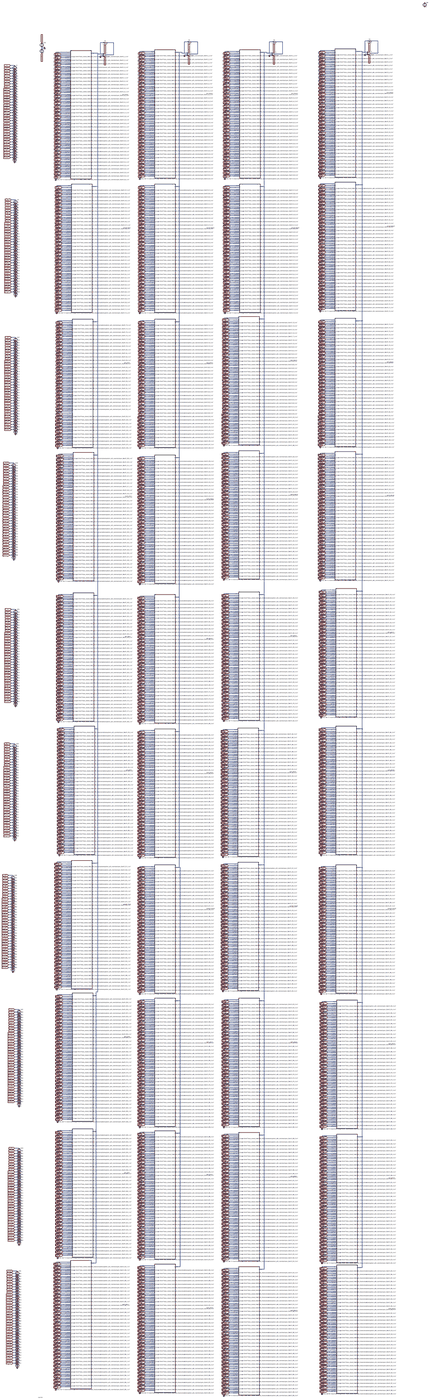
[diagram p0: schematic bangla_font_pattern_arka.asc, whole sheet]
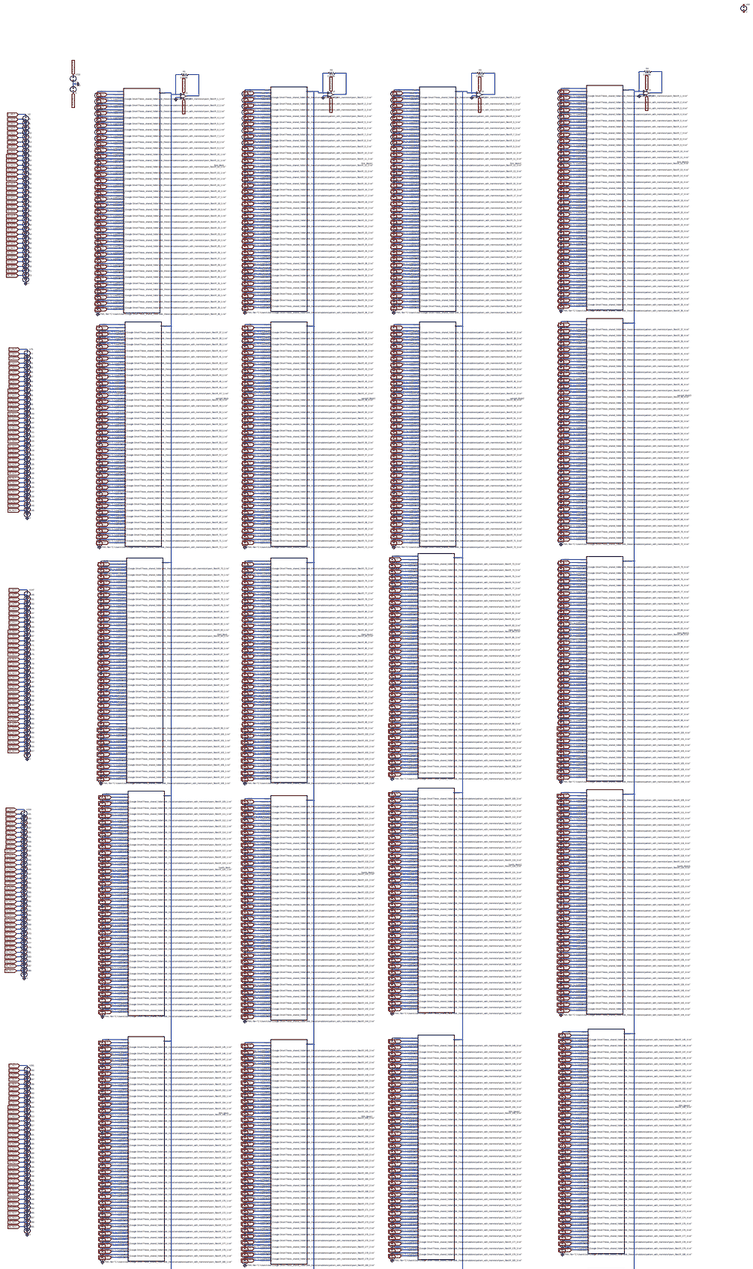
[diagram p1: schematic bangla_font_pattern_arka.asc, part, row 1 of 2, column 1 of 1]
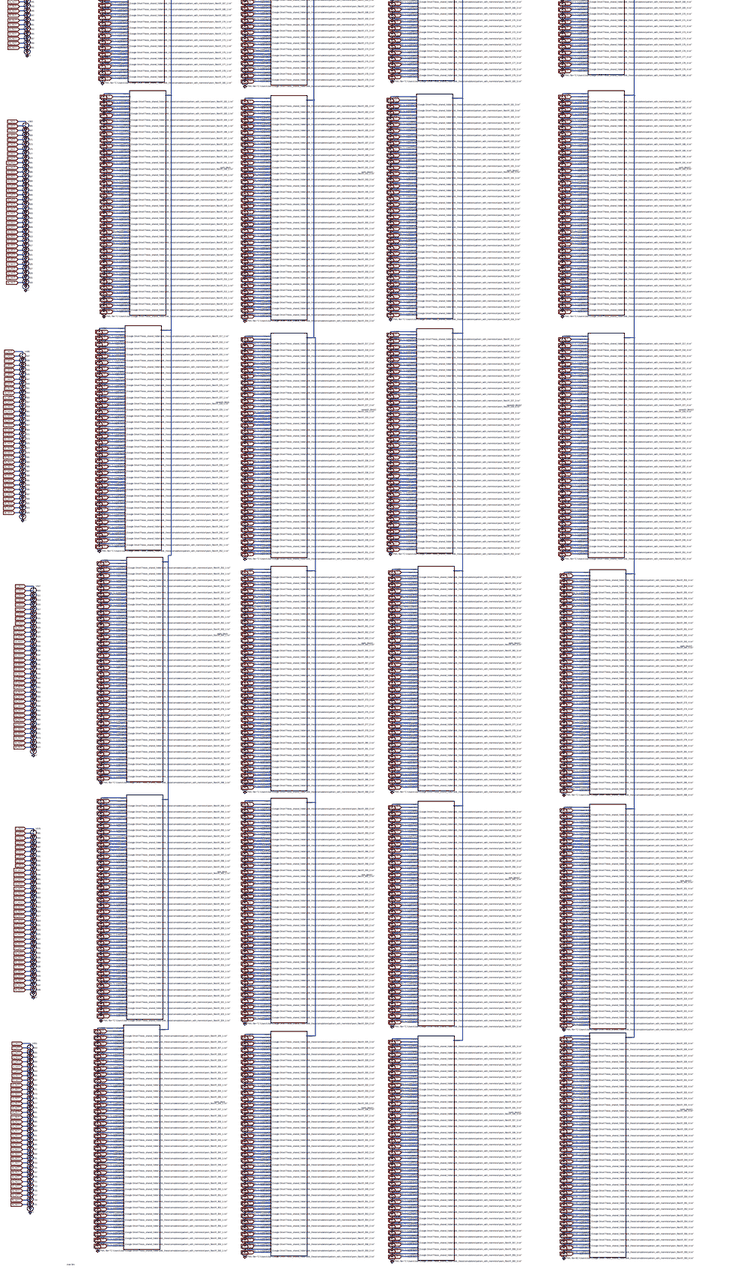
[diagram p2: schematic bangla_font_pattern_arka.asc, part, row 2 of 2, column 1 of 1]
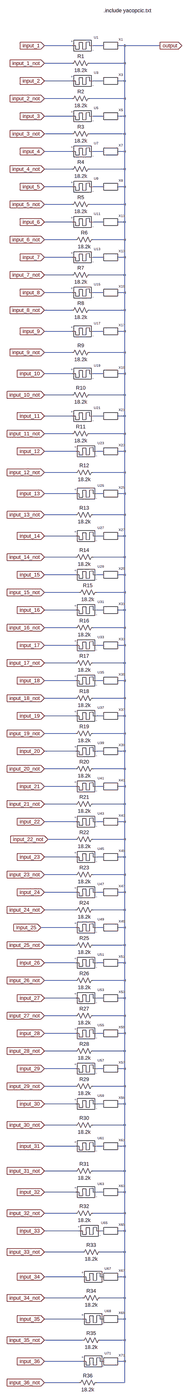
[diagram p3: sub-circuit memristor_block.asc, whole sheet]
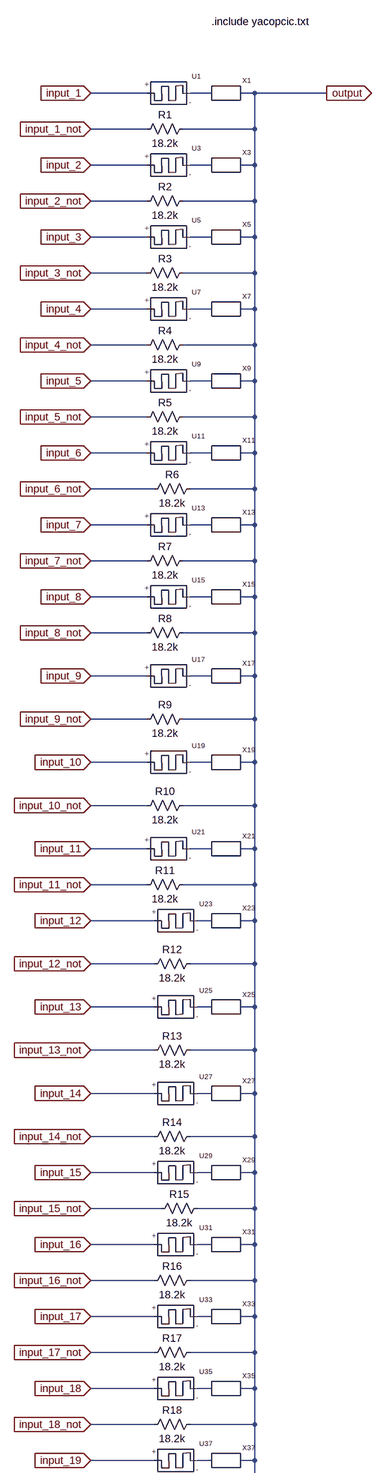
[diagram p4: sub-circuit memristor_block.asc, part, row 1 of 2, column 1 of 1]
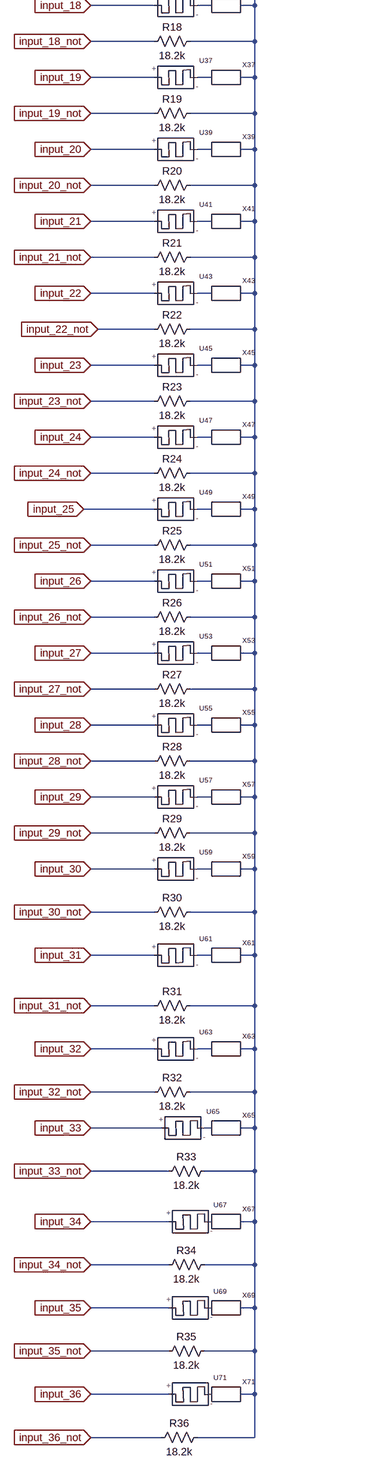
[diagram p5: sub-circuit memristor_block.asc, part, row 2 of 2, column 1 of 1]
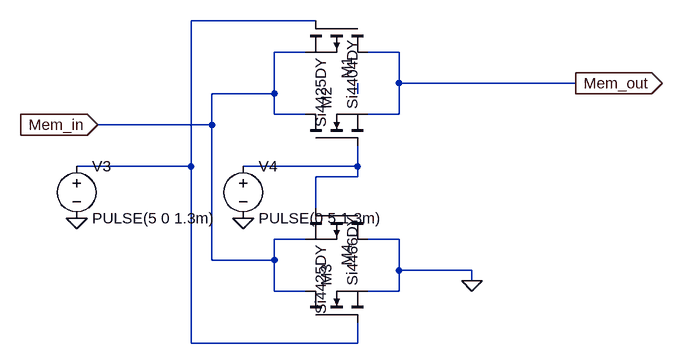
[diagram p6: sub-circuit programmer_with_transmission.asc]
* bangla_font_pattern_arka.asc
Xfirst_block N012 1_NOT N016 2_NOT N020 3_NOT N024 4_NOT N028 5_NOT N032 6_NOT N036 7_NOT N040 8_NOT N007 N044 9_NOT N048 10_NOT N052 11_NOT N056 12_NOT N060 13_NOT N064 14_NOT N068 15_NOT N072 16_NOT N076 17_NOT N080 18_NOT N084 19_NOT N088 20_NOT N092 21_NOT N096 22_NOT N100 23_NOT N104 24_NOT N108 25_NOT N112 26_NOT N116 27_NOT N120 28_NOT N124 29_NOT N128 30_NOT N132 31_NOT N136 32_NOT N140 33_NOT N144 34_NOT N148 35_NOT N152 36_NOT memristor_block
V1 N012 0 PWL file="C:\Users\Anik\Google Drive\Thesis_shared_folder\anik_thesis\simulations\pattern_with_memristor\pwm_files\R_1_1.txt"
V3 N016 0 PWL file="C:\Users\Anik\Google Drive\Thesis_shared_folder\anik_thesis\simulations\pattern_with_memristor\pwm_files\R_2_1.txt"
V5 N020 0 PWL file="C:\Users\Anik\Google Drive\Thesis_shared_folder\anik_thesis\simulations\pattern_with_memristor\pwm_files\R_3_1.txt"
V7 N024 0 PWL file="C:\Users\Anik\Google Drive\Thesis_shared_folder\anik_thesis\simulations\pattern_with_memristor\pwm_files\R_4_1.txt"
V9 N028 0 PWL file="C:\Users\Anik\Google Drive\Thesis_shared_folder\anik_thesis\simulations\pattern_with_memristor\pwm_files\R_5_1.txt"
V11 N032 0 PWL file="C:\Users\Anik\Google Drive\Thesis_shared_folder\anik_thesis\simulations\pattern_with_memristor\pwm_files\R_6_1.txt"
V13 N036 0 PWL file="C:\Users\Anik\Google Drive\Thesis_shared_folder\anik_thesis\simulations\pattern_with_memristor\pwm_files\R_7_1.txt"
V15 N040 0 PWL file="C:\Users\Anik\Google Drive\Thesis_shared_folder\anik_thesis\simulations\pattern_with_memristor\pwm_files\R_8_1.txt"
V17 N044 0 PWL file="C:\Users\Anik\Google Drive\Thesis_shared_folder\anik_thesis\simulations\pattern_with_memristor\pwm_files\R_9_1.txt"
V19 N048 0 PWL file="C:\Users\Anik\Google Drive\Thesis_shared_folder\anik_thesis\simulations\pattern_with_memristor\pwm_files\R_10_1.txt"
V21 N052 0 PWL file="C:\Users\Anik\Google Drive\Thesis_shared_folder\anik_thesis\simulations\pattern_with_memristor\pwm_files\R_11_1.txt"
V23 N056 0 PWL file="C:\Users\Anik\Google Drive\Thesis_shared_folder\anik_thesis\simulations\pattern_with_memristor\pwm_files\R_12_1.txt"
V25 N060 0 PWL file="C:\Users\Anik\Google Drive\Thesis_shared_folder\anik_thesis\simulations\pattern_with_memristor\pwm_files\R_13_1.txt"
V27 N064 0 PWL file="C:\Users\Anik\Google Drive\Thesis_shared_folder\anik_thesis\simulations\pattern_with_memristor\pwm_files\R_14_1.txt"
V29 N068 NC_01 PWL file="C:\Users\Anik\Google Drive\Thesis_shared_folder\anik_thesis\simulations\pattern_with_memristor\pwm_files\R_15_1.txt"
V31 N072 0 PWL file="C:\Users\User\Google Drive\Thesis_shared_folder\anik_thesis\simulations\pattern_with_memristor\pwm_files\R_16_1.txt"
V33 N076 0 PWL file="C:\Users\User\Google Drive\Thesis_shared_folder\anik_thesis\simulations\pattern_with_memristor\pwm_files\R_17_1.txt"
V35 N080 NC_02 PWL file="C:\Users\User\Google Drive\Thesis_shared_folder\anik_thesis\simulations\pattern_with_memristor\pwm_files\R_18_1.txt"
V37 N084 0 PWL file="C:\Users\User\Google Drive\Thesis_shared_folder\anik_thesis\simulations\pattern_with_memristor\pwm_files\R_19_1.txt"
V39 N088 0 PWL file="C:\Users\User\Google Drive\Thesis_shared_folder\anik_thesis\simulations\pattern_with_memristor\pwm_files\R_20_1.txt"
V41 N092 0 PWL file="C:\Users\User\Google Drive\Thesis_shared_folder\anik_thesis\simulations\pattern_with_memristor\pwm_files\R_21_1.txt"
V43 N096 0 PWL file="C:\Users\User\Google Drive\Thesis_shared_folder\anik_thesis\simulations\pattern_with_memristor\pwm_files\R_22_1.txt"
V45 N100 0 PWL file="C:\Users\User\Google Drive\Thesis_shared_folder\anik_thesis\simulations\pattern_with_memristor\pwm_files\R_23_1.txt"
V47 N104 0 PWL file="C:\Users\User\Google Drive\Thesis_shared_folder\anik_thesis\simulations\pattern_with_memristor\pwm_files\R_24_1.txt"
V49 N108 0 PWL file="C:\Users\User\Google Drive\Thesis_shared_folder\anik_thesis\simulations\pattern_with_memristor\pwm_files\R_25_1.txt"
V51 N112 0 PWL file="C:\Users\User\Google Drive\Thesis_shared_folder\anik_thesis\simulations\pattern_with_memristor\pwm_files\R_26_1.txt"
V53 N116 0 PWL file="C:\Users\User\Google Drive\Thesis_shared_folder\anik_thesis\simulations\pattern_with_memristor\pwm_files\R_27_1.txt"
V55 N120 0 PWL file="C:\Users\User\Google Drive\Thesis_shared_folder\anik_thesis\simulations\pattern_with_memristor\pwm_files\R_28_1.txt"
V57 N124 0 PWL file="C:\Users\User\Google Drive\Thesis_shared_folder\anik_thesis\simulations\pattern_with_memristor\pwm_files\R_29_1.txt"
V59 N128 0 PWL file="C:\Users\User\Google Drive\Thesis_shared_folder\anik_thesis\simulations\pattern_with_memristor\pwm_files\R_30_1.txt"
V61 N132 0 PWL file="C:\Users\User\Google Drive\Thesis_shared_folder\anik_thesis\simulations\pattern_with_memristor\pwm_files\R_31_1.txt"
V63 N136 0 PWL file="C:\Users\User\Google Drive\Thesis_shared_folder\anik_thesis\simulations\pattern_with_memristor\pwm_files\R_32_1.txt"
V65 N140 0 PWL file="C:\Users\User\Google Drive\Thesis_shared_folder\anik_thesis\simulations\pattern_with_memristor\pwm_files\R_33_1.txt"
V67 N144 0 PWL file="C:\Users\User\Google Drive\Thesis_shared_folder\anik_thesis\simulations\pattern_with_memristor\pwm_files\R_34_1.txt"
V69 NC_03 NC_04 V
V70 N148 0 PWL file="C:\Users\User\Google Drive\Thesis_shared_folder\anik_thesis\simulations\pattern_with_memristor\pwm_files\R_35_1.txt"
V72 N152 0 PWL file="C:\Users\User\Google Drive\Thesis_shared_folder\anik_thesis\simulations\pattern_with_memristor\pwm_files\R_36_1.txt"
Xsecond_block N154 37_NOT N158 38_NOT N162 39_NOT N166 40_NOT N170 41_NOT N174 42_NOT N178 43_NOT N182 44_NOT N007 N186 45_NOT N190 46_NOT N194 47_NOT N198 48_NOT N202 49_NOT N206 50_NOT N210 51_NOT N214 52_NOT N218 53_NOT N222 54_NOT N226 55_NOT N230 56_NOT N234 57_NOT N238 58_NOT N242 59_NOT N246 60_NOT N250 61_NOT N254 62_NOT N258 63_NOT N262 64_NOT N266 65_NOT N270 66_NOT N274 67_NOT N278 68_NOT N282 69_NOT N286 70_NOT N290 71_NOT N294 72_NOT memristor_block
V74 N154 0 PWL file="C:\Users\User\Google Drive\Thesis_shared_folder\anik_thesis\simulations\pattern_with_memristor\pwm_files\R_37_1.txt"
V76 N158 0 PWL file="C:\Users\User\Google Drive\Thesis_shared_folder\anik_thesis\simulations\pattern_with_memristor\pwm_files\R_38_1.txt"
V78 N162 0 PWL file="C:\Users\User\Google Drive\Thesis_shared_folder\anik_thesis\simulations\pattern_with_memristor\pwm_files\R_39_1.txt"
V80 N166 0 PWL file="C:\Users\User\Google Drive\Thesis_shared_folder\anik_thesis\simulations\pattern_with_memristor\pwm_files\R_40_1.txt"
V82 N170 0 PWL file="C:\Users\User\Google Drive\Thesis_shared_folder\anik_thesis\simulations\pattern_with_memristor\pwm_files\R_41_1.txt"
V84 N174 0 PWL file="C:\Users\User\Google Drive\Thesis_shared_folder\anik_thesis\simulations\pattern_with_memristor\pwm_files\R_42_1.txt"
V86 N178 0 PWL file="C:\Users\User\Google Drive\Thesis_shared_folder\anik_thesis\simulations\pattern_with_memristor\pwm_files\R_43_1.txt"
V88 N182 0 PWL file="C:\Users\User\Google Drive\Thesis_shared_folder\anik_thesis\simulations\pattern_with_memristor\pwm_files\R_44_1.txt"
V90 N186 0 PWL file="C:\Users\User\Google Drive\Thesis_shared_folder\anik_thesis\simulations\pattern_with_memristor\pwm_files\R_45_1.txt"
V92 N190 0 PWL file="C:\Users\User\Google Drive\Thesis_shared_folder\anik_thesis\simulations\pattern_with_memristor\pwm_files\R_46_1.txt"
V94 N194 0 PWL file="C:\Users\User\Google Drive\Thesis_shared_folder\anik_thesis\simulations\pattern_with_memristor\pwm_files\R_4\7_1.txt"
V96 N198 0 PWL file="C:\Users\User\Google Drive\Thesis_shared_folder\anik_thesis\simulations\pattern_with_memristor\pwm_files\R_48_1.txt"
V98 N202 0 PWL file="C:\Users\User\Google Drive\Thesis_shared_folder\anik_thesis\simulations\pattern_with_memristor\pwm_files\R_49_1.txt"
V100 N206 0 PWL file="C:\Users\User\Google Drive\Thesis_shared_folder\anik_thesis\simulations\pattern_with_memristor\pwm_files\R_50_1.txt"
V102 N210 NC_05 PWL file="C:\Users\User\Google Drive\Thesis_shared_folder\anik_thesis\simulations\pattern_with_memristor\pwm_files\R_51_1.txt"
V104 N214 0 PWL file="C:\Users\User\Google Drive\Thesis_shared_folder\anik_thesis\simulations\pattern_with_memristor\pwm_files\R_52_1.txt"
V106 N218 0 PWL file="C:\Users\User\Google Drive\Thesis_shared_folder\anik_thesis\simulations\pattern_with_memristor\pwm_files\R_53_1.txt"
V108 N222 NC_06 PWL file="C:\Users\User\Google Drive\Thesis_shared_folder\anik_thesis\simulations\pattern_with_memristor\pwm_files\R_54_1.txt"
V110 N226 0 PWL file="C:\Users\User\Google Drive\Thesis_shared_folder\anik_thesis\simulations\pattern_with_memristor\pwm_files\R_55_1.txt"
V112 N230 0 PWL file="C:\Users\User\Google Drive\Thesis_shared_folder\anik_thesis\simulations\pattern_with_memristor\pwm_files\R_56_1.txt"
V114 N234 0 PWL file="C:\Users\User\Google Drive\Thesis_shared_folder\anik_thesis\simulations\pattern_with_memristor\pwm_files\R_57_1.txt"
V116 N238 0 PWL file="C:\Users\User\Google Drive\Thesis_shared_folder\anik_thesis\simulations\pattern_with_memristor\pwm_files\R_58_1.txt"
V118 N242 0 PWL file="C:\Users\User\Google Drive\Thesis_shared_folder\anik_thesis\simulations\pattern_with_memristor\pwm_files\R_59_1.txt"
V120 N246 0 PWL file="C:\Users\User\Google Drive\Thesis_shared_folder\anik_thesis\simulations\pattern_with_memristor\pwm_files\R_60_1.txt"
V122 N250 0 PWL file="C:\Users\User\Google Drive\Thesis_shared_folder\anik_thesis\simulations\pattern_with_memristor\pwm_files\R_61_1.txt"
V124 N254 0 PWL file="C:\Users\User\Google Drive\Thesis_shared_folder\anik_thesis\simulations\pattern_with_memristor\pwm_files\R_62_1.txt"
V126 N258 0 PWL file="C:\Users\User\Google Drive\Thesis_shared_folder\anik_thesis\simulations\pattern_with_memristor\pwm_files\R_63_1.txt"
V128 N262 0 PWL file="C:\Users\User\Google Drive\Thesis_shared_folder\anik_thesis\simulations\pattern_with_memristor\pwm_files\R_64_1.txt"
V130 N266 0 PWL file="C:\Users\User\Google Drive\Thesis_shared_folder\anik_thesis\simulations\pattern_with_memristor\pwm_files\R_65_1.txt"
V132 N270 0 PWL file="C:\Users\User\Google Drive\Thesis_shared_folder\anik_thesis\simulations\pattern_with_memristor\pwm_files\R_66_1.txt"
V134 N274 0 PWL file="C:\Users\User\Google Drive\Thesis_shared_folder\anik_thesis\simulations\pattern_with_memristor\pwm_files\R_67_1.txt"
V136 N278 0 PWL file="C:\Users\User\Google Drive\Thesis_shared_folder\anik_thesis\simulations\pattern_with_memristor\pwm_files\R_68_1.txt"
V138 N282 0 PWL file="C:\Users\User\Google Drive\Thesis_shared_folder\anik_thesis\simulations\pattern_with_memristor\pwm_files\R_69_1.txt"
V140 N286 0 PWL file="C:\Users\User\Google Drive\Thesis_shared_folder\anik_thesis\simulations\pattern_with_memristor\pwm_files\R_70_1.txt"
V142 N290 0 PWL file="C:\Users\User\Google Drive\Thesis_shared_folder\anik_thesis\simulations\pattern_with_memristor\pwm_files\R_71_1.txt"
V144 N294 0 PWL file="C:\Users\User\Google Drive\Thesis_shared_folder\anik_thesis\simulations\pattern_with_memristor\pwm_files\R_72_1.txt"
Xthird_block N299 73_NOT N303 74_NOT N307 75_NOT N311 76_NOT N315 77_NOT N319 78_NOT N323 79_NOT N327 80_NOT N007 N331 81_NOT N335 82_NOT N339 83_NOT N343 84_NOT N347 85_NOT N351 86_NOT N355 87_NOT N359 88_NOT N363 89_NOT N367 90_NOT N371 91_NOT N375 92_NOT N379 93_NOT N383 94_NOT N387 95_NOT N391 96_NOT N395 97_NOT N399 98_NOT N403 99_NOT N407 100_NOT N411 101_NOT N415 102_NOT N419 103_NOT N423 104_NOT N427 105_NOT N431 106_NOT N435 107_NOT N439 108_NOT memristor_block
V146 N299 0 PWL file="C:\Users\User\Google Drive\Thesis_shared_folder\anik_thesis\simulations\pattern_with_memristor\pwm_files\R_73_1.txt"
V148 N303 0 PWL file="C:\Users\User\Google Drive\Thesis_shared_folder\anik_thesis\simulations\pattern_with_memristor\pwm_files\R_74_1.txt"
V150 N307 0 PWL file="C:\Users\User\Google Drive\Thesis_shared_folder\anik_thesis\simulations\pattern_with_memristor\pwm_files\R_75_1.txt"
V152 N311 0 PWL file="C:\Users\User\Google Drive\Thesis_shared_folder\anik_thesis\simulations\pattern_with_memristor\pwm_files\R_76_1.txt"
V154 N315 0 PWL file="C:\Users\User\Google Drive\Thesis_shared_folder\anik_thesis\simulations\pattern_with_memristor\pwm_files\R_77_1.txt"
V156 N319 0 PWL file="C:\Users\User\Google Drive\Thesis_shared_folder\anik_thesis\simulations\pattern_with_memristor\pwm_files\R_78_1.txt"
V158 N323 0 PWL file="C:\Users\User\Google Drive\Thesis_shared_folder\anik_thesis\simulations\pattern_with_memristor\pwm_files\R_79_1.txt"
V160 N327 0 PWL file="C:\Users\User\Google Drive\Thesis_shared_folder\anik_thesis\simulations\pattern_with_memristor\pwm_files\R_80_1.txt"
V162 N331 0 PWL file="C:\Users\User\Google Drive\Thesis_shared_folder\anik_thesis\simulations\pattern_with_memristor\pwm_files\R_81_1.txt"
V164 N335 0 PWL file="C:\Users\User\Google Drive\Thesis_shared_folder\anik_thesis\simulations\pattern_with_memristor\pwm_files\R_82_1.txt"
V166 N339 0 PWL file="C:\Users\User\Google Drive\Thesis_shared_folder\anik_thesis\simulations\pattern_with_memristor\pwm_files\R_83_1.txt"
V168 N343 0 PWL file="C:\Users\User\Google Drive\Thesis_shared_folder\anik_thesis\simulations\pattern_with_memristor\pwm_files\R_84_1.txt"
V170 N347 0 PWL file="C:\Users\User\Google Drive\Thesis_shared_folder\anik_thesis\simulations\pattern_with_memristor\pwm_files\R_85_1.txt"
V172 N351 0 PWL file="C:\Users\User\Google Drive\Thesis_shared_folder\anik_thesis\simulations\pattern_with_memristor\pwm_files\R_86_1.txt"
V174 N355 0 PWL file="C:\Users\User\Google Drive\Thesis_shared_folder\anik_thesis\simulations\pattern_with_memristor\pwm_files\R_87_1.txt"
V176 N359 0 PWL file="C:\Users\User\Google Drive\Thesis_shared_folder\anik_thesis\simulations\pattern_with_memristor\pwm_files\R_88_1.txt"
V178 N363 0 PWL file="C:\Users\User\Google Drive\Thesis_shared_folder\anik_thesis\simulations\pattern_with_memristor\pwm_files\R_89_1.txt"
V180 N367 0 PWL file="C:\Users\User\Google Drive\Thesis_shared_folder\anik_thesis\simulations\pattern_with_memristor\pwm_files\R_90_1.txt"
V182 N371 0 PWL file="C:\Users\User\Google Drive\Thesis_shared_folder\anik_thesis\simulations\pattern_with_memristor\pwm_files\R_91_1.txt"
V184 N375 0 PWL file="C:\Users\User\Google Drive\Thesis_shared_folder\anik_thesis\simulations\pattern_with_memristor\pwm_files\R_92_1.txt"
V186 N379 0 PWL file="C:\Users\User\Google Drive\Thesis_shared_folder\anik_thesis\simulations\pattern_with_memristor\pwm_files\R_93_1.txt"
V188 N383 0 PWL file="C:\Users\User\Google Drive\Thesis_shared_folder\anik_thesis\simulations\pattern_with_memristor\pwm_files\R_94_1.txt"
V190 N387 0 PWL file="C:\Users\User\Google Drive\Thesis_shared_folder\anik_thesis\simulations\pattern_with_memristor\pwm_files\R_95_1.txt"
V192 N391 0 PWL file="C:\Users\User\Google Drive\Thesis_shared_folder\anik_thesis\simulations\pattern_with_memristor\pwm_files\R_96_1.txt"
V194 N395 0 PWL file="C:\Users\User\Google Drive\Thesis_shared_folder\anik_thesis\simulations\pattern_with_memristor\pwm_files\R_98_1.txt"
V196 N399 0 V
V198 N403 0 PWL file="C:\Users\User\Google Drive\Thesis_shared_folder\anik_thesis\simulations\pattern_with_memristor\pwm_files\R_99_1.txt"
V200 N407 0 PWL file="C:\Users\User\Google Drive\Thesis_shared_folder\anik_thesis\simulations\pattern_with_memristor\pwm_files\R_100_1.txt"
V202 N411 0 PWL file="C:\Users\User\Google Drive\Thesis_shared_folder\anik_thesis\simulations\pattern_with_memristor\pwm_files\R_101_1.txt"
V204 N415 0 PWL file="C:\Users\User\Google Drive\Thesis_shared_folder\anik_thesis\simulations\pattern_with_memristor\pwm_files\R_102_1.txt"
V206 N419 0 PWL file="C:\Users\User\Google Drive\Thesis_shared_folder\anik_thesis\simulations\pattern_with_memristor\pwm_files\R_103_1.txt"
V208 N423 0 PWL file="C:\Users\User\Google Drive\Thesis_shared_folder\anik_thesis\simulations\pattern_with_memristor\pwm_files\R_104_1.txt"
V210 N427 0 PWL file="C:\Users\User\Google Drive\Thesis_shared_folder\anik_thesis\simulations\pattern_with_memristor\pwm_files\R_105_1.txt"
V212 N431 0 PWL file="C:\Users\User\Google Drive\Thesis_shared_folder\anik_thesis\simulations\pattern_with_memristor\pwm_files\R_106_1.txt"
V214 N435 0 PWL file="C:\Users\User\Google Drive\Thesis_shared_folder\anik_thesis\simulations\pattern_with_memristor\pwm_files\R_107_1.txt"
V216 N439 0 PWL file="C:\Users\User\Google Drive\Thesis_shared_folder\anik_thesis\simulations\pattern_with_memristor\pwm_files\R_108_1.txt"
Xfourth_block N443 109_NOT N447 110_NOT N451 111_NOT N455 112_NOT N459 113_NOT N463 114_NOT N467 115_NOT N471 116_NOT N007 N475 117_NOT N479 118_NOT N483 119_NOT N487 120_NOT N491 121_NOT N495 122_NOT N499 123_NOT N503 124_NOT N507 125_NOT N511 126_NOT N515 127_NOT N519 128_NOT N523 129_NOT N527 130_NOT N531 131_NOT N535 132_NOT N539 133_NOT N543 134_NOT N547 135_NOT N551 136_NOT N555 137_NOT N559 138_NOT N563 139_NOT N567 140_NOT N571 141_NOT N575 142_NOT N579 143_NOT N583 144_NOT memristor_block
V218 N443 0 PWL file="C:\Users\User\Google Drive\Thesis_shared_folder\anik_thesis\simulations\pattern_with_memristor\pwm_files\R_109_1.txt"
V220 N447 0 PWL file="C:\Users\User\Google Drive\Thesis_shared_folder\anik_thesis\simulations\pattern_with_memristor\pwm_files\R_110_1.txt"
V222 N451 0 PWL file="C:\Users\User\Google Drive\Thesis_shared_folder\anik_thesis\simulations\pattern_with_memristor\pwm_files\R_111_1.txt"
V224 N455 0 PWL file="C:\Users\User\Google Drive\Thesis_shared_folder\anik_thesis\simulations\pattern_with_memristor\pwm_files\R_112_1.txt"
V226 N459 0 PWL file="C:\Users\User\Google Drive\Thesis_shared_folder\anik_thesis\simulations\pattern_with_memristor\pwm_files\R_113_1.txt"
V228 N463 0 PWL file="C:\Users\User\Google Drive\Thesis_shared_folder\anik_thesis\simulations\pattern_with_memristor\pwm_files\R_114_1.txt"
V230 N467 0 PWL file="C:\Users\User\Google Drive\Thesis_shared_folder\anik_thesis\simulations\pattern_with_memristor\pwm_files\R_115_1.txt"
V232 N471 0 PWL file="C:\Users\User\Google Drive\Thesis_shared_folder\anik_thesis\simulations\pattern_with_memristor\pwm_files\R_116_1.txt"
V234 N475 0 PWL file="C:\Users\User\Google Drive\Thesis_shared_folder\anik_thesis\simulations\pattern_with_memristor\pwm_files\R_117_1.txt"
V236 N479 0 PWL file="C:\Users\User\Google Drive\Thesis_shared_folder\anik_thesis\simulations\pattern_with_memristor\pwm_files\R_118_1.txt"
V238 N483 0 PWL file="C:\Users\User\Google Drive\Thesis_shared_folder\anik_thesis\simulations\pattern_with_memristor\pwm_files\R_119_1.txt"
V240 N487 0 PWL file="C:\Users\User\Google Drive\Thesis_shared_folder\anik_thesis\simulations\pattern_with_memristor\pwm_files\R_120_1.txt"
V242 N491 0 PWL file="C:\Users\User\Google Drive\Thesis_shared_folder\anik_thesis\simulations\pattern_with_memristor\pwm_files\R_121_1.txt"
V244 N495 0 PWL file="C:\Users\User\Google Drive\Thesis_shared_folder\anik_thesis\simulations\pattern_with_memristor\pwm_files\R_122_1.txt"
V246 N499 0 PWL file="C:\Users\User\Google Drive\Thesis_shared_folder\anik_thesis\simulations\pattern_with_memristor\pwm_files\R_123_1.txt"
V248 N503 0 PWL file="C:\Users\User\Google Drive\Thesis_shared_folder\anik_thesis\simulations\pattern_with_memristor\pwm_files\R_124_1.txt"
V250 N507 0 PWL file="C:\Users\User\Google Drive\Thesis_shared_folder\anik_thesis\simulations\pattern_with_memristor\pwm_files\R_125_1.txt"
V252 N511 0 PWL file="C:\Users\User\Google Drive\Thesis_shared_folder\anik_thesis\simulations\pattern_with_memristor\pwm_files\R_126_1.txt"
V254 N515 0 PWL file="C:\Users\User\Google Drive\Thesis_shared_folder\anik_thesis\simulations\pattern_with_memristor\pwm_files\R_127_1.txt"
V256 N519 0 PWL file="C:\Users\User\Google Drive\Thesis_shared_folder\anik_thesis\simulations\pattern_with_memristor\pwm_files\R_128_1.txt"
V258 N523 0 PWL file="C:\Users\User\Google Drive\Thesis_shared_folder\anik_thesis\simulations\pattern_with_memristor\pwm_files\R_129_1.txt"
V260 N527 0 PWL file="C:\Users\User\Google Drive\Thesis_shared_folder\anik_thesis\simulations\pattern_with_memristor\pwm_files\R_130_1.txt"
V262 N531 0 PWL file="C:\Users\User\Google Drive\Thesis_shared_folder\anik_thesis\simulations\pattern_with_memristor\pwm_files\R_131_1.txt"
V264 N535 0 PWL file="C:\Users\User\Google Drive\Thesis_shared_folder\anik_thesis\simulations\pattern_with_memristor\pwm_files\R_132_1.txt"
V266 N539 0 PWL file="C:\Users\User\Google Drive\Thesis_shared_folder\anik_thesis\simulations\pattern_with_memristor\pwm_files\R_133_1.txt"
V268 N543 0 PWL file="C:\Users\User\Google Drive\Thesis_shared_folder\anik_thesis\simulations\pattern_with_memristor\pwm_files\R_134_1.txt"
V270 N547 0 PWL file="C:\Users\User\Google Drive\Thesis_shared_folder\anik_thesis\simulations\pattern_with_memristor\pwm_files\R_135_1.txt"
V272 N551 0 PWL file="C:\Users\User\Google Drive\Thesis_shared_folder\anik_thesis\simulations\pattern_with_memristor\pwm_files\R_136_1.txt"
V274 N555 0 PWL file="C:\Users\User\Google Drive\Thesis_shared_folder\anik_thesis\simulations\pattern_with_memristor\pwm_files\R_137_1.txt"
V276 N559 0 PWL file="C:\Users\User\Google Drive\Thesis_shared_folder\anik_thesis\simulations\pattern_with_memristor\pwm_files\R_138_1.txt"
V278 N563 0 PWL file="C:\Users\User\Google Drive\Thesis_shared_folder\anik_thesis\simulations\pattern_with_memristor\pwm_files\R_139_1.txt"
V280 N567 0 PWL file="C:\Users\User\Google Drive\Thesis_shared_folder\anik_thesis\simulations\pattern_with_memristor\pwm_files\R_140_1.txt"
V282 N571 0 PWL file="C:\Users\User\Google Drive\Thesis_shared_folder\anik_thesis\simulations\pattern_with_memristor\pwm_files\R_141_1.txt"
V284 N575 0 PWL file="C:\Users\User\Google Drive\Thesis_shared_folder\anik_thesis\simulations\pattern_with_memristor\pwm_files\R_142_1.txt"
V286 N579 0 PWL file="C:\Users\User\Google Drive\Thesis_shared_folder\anik_thesis\simulations\pattern_with_memristor\pwm_files\R_143_1.txt"
V288 N583 0 PWL file="C:\Users\User\Google Drive\Thesis_shared_folder\anik_thesis\simulations\pattern_with_memristor\pwm_files\R_144_1.txt"
Xfifth_block N588 145_NOT N592 146_NOT N596 147_NOT N600 148_NOT N604 149_NOT N608 150_NOT N612 151_NOT N616 152_NOT N007 N620 153_NOT N624 154_NOT N628 155_NOT N632 156_NOT N636 157_NOT N640 158_NOT N644 159_NOT N648 160_NOT N652 161_NOT N656 162_NOT N660 163_NOT N664 164_NOT N668 165_NOT N672 166_NOT N676 167_NOT N680 168_NOT N684 169_NOT N688 170_NOT N692 171_NOT N696 172_NOT N700 173_NOT N704 174_NOT N708 175_NOT N712 176_NOT N716 177_NOT N720 178_NOT N724 179_NOT N727 180_NOT memristor_block
V290 N588 0 PWL file="C:\Users\User\Google Drive\Thesis_shared_folder\anik_thesis\simulations\pattern_with_memristor\pwm_files\R_145_1.txt"
V292 N592 0 PWL file="C:\Users\User\Google Drive\Thesis_shared_folder\anik_thesis\simulations\pattern_with_memristor\pwm_files\R_146_1.txt"
V294 N596 0 PWL file="C:\Users\User\Google Drive\Thesis_shared_folder\anik_thesis\simulations\pattern_with_memristor\pwm_files\R_147_1.txt"
V296 N600 0 PWL file="C:\Users\User\Google Drive\Thesis_shared_folder\anik_thesis\simulations\pattern_with_memristor\pwm_files\R_148_1.txt"
V298 N604 0 PWL file="C:\Users\User\Google Drive\Thesis_shared_folder\anik_thesis\simulations\pattern_with_memristor\pwm_files\R_149_1.txt"
V300 N608 0 PWL file="C:\Users\User\Google Drive\Thesis_shared_folder\anik_thesis\simulations\pattern_with_memristor\pwm_files\R_150_1.txt"
V302 N612 0 PWL file="C:\Users\User\Google Drive\Thesis_shared_folder\anik_thesis\simulations\pattern_with_memristor\pwm_files\R_151_1.txt"
V304 N616 0 PWL file="C:\Users\User\Google Drive\Thesis_shared_folder\anik_thesis\simulations\pattern_with_memristor\pwm_files\R_152_1.txt"
V306 N620 0 PWL file="C:\Users\User\Google Drive\Thesis_shared_folder\anik_thesis\simulations\pattern_with_memristor\pwm_files\R_153_1.txt"
V308 N624 0 PWL file="C:\Users\User\Google Drive\Thesis_shared_folder\anik_thesis\simulations\pattern_with_memristor\pwm_files\R_154_1.txt"
V310 N628 0 PWL file="C:\Users\User\Google Drive\Thesis_shared_folder\anik_thesis\simulations\pattern_with_memristor\pwm_files\R_155_1.txt"
V312 N632 0 PWL file="C:\Users\User\Google Drive\Thesis_shared_folder\anik_thesis\simulations\pattern_with_memristor\pwm_files\R_156_1.txt"
V314 N636 0 PWL file="C:\Users\User\Google Drive\Thesis_shared_folder\anik_thesis\simulations\pattern_with_memristor\pwm_files\R_157_1.txt"
V316 N640 0 PWL file="C:\Users\User\Google Drive\Thesis_shared_folder\anik_thesis\simulations\pattern_with_memristor\pwm_files\R_158_1.txt"
V318 N644 0 PWL file="C:\Users\User\Google Drive\Thesis_shared_folder\anik_thesis\simulations\pattern_with_memristor\pwm_files\R_159_1.txt"
V320 N648 0 PWL file="C:\Users\User\Google Drive\Thesis_shared_folder\anik_thesis\simulations\pattern_with_memristor\pwm_files\R_159_1.txt"
V322 N652 0 PWL file="C:\Users\User\Google Drive\Thesis_shared_folder\anik_thesis\simulations\pattern_with_memristor\pwm_files\R_161_1.txt"
V324 N656 0 PWL file="C:\Users\User\Google Drive\Thesis_shared_folder\anik_thesis\simulations\pattern_with_memristor\pwm_files\R_162_1.txt"
V326 N660 0 PWL file="C:\Users\User\Google Drive\Thesis_shared_folder\anik_thesis\simulations\pattern_with_memristor\pwm_files\R_163_1.txt"
V328 N664 0 PWL file="C:\Users\User\Google Drive\Thesis_shared_folder\anik_thesis\simulations\pattern_with_memristor\pwm_files\R_164_1.txt"
V330 N668 0 PWL file="C:\Users\User\Google Drive\Thesis_shared_folder\anik_thesis\simulations\pattern_with_memristor\pwm_files\R_165_1.txt"
V332 N672 0 PWL file="C:\Users\User\Google Drive\Thesis_shared_folder\anik_thesis\simulations\pattern_with_memristor\pwm_files\R_166_1.txt"
V334 N676 0 PWL file="C:\Users\User\Google Drive\Thesis_shared_folder\anik_thesis\simulations\pattern_with_memristor\pwm_files\R_167_1.txt"
V336 N680 0 PWL file="C:\Users\User\Google Drive\Thesis_shared_folder\anik_thesis\simulations\pattern_with_memristor\pwm_files\R_168_1.txt"
V338 N684 0 PWL file="C:\Users\User\Google Drive\Thesis_shared_folder\anik_thesis\simulations\pattern_with_memristor\pwm_files\R_169_1.txt"
V340 N688 0 PWL file="C:\Users\User\Google Drive\Thesis_shared_folder\anik_thesis\simulations\pattern_with_memristor\pwm_files\R_170_1.txt"
V342 N692 0 PWL file="C:\Users\User\Google Drive\Thesis_shared_folder\anik_thesis\simulations\pattern_with_memristor\pwm_files\R_171_1.txt"
V344 N696 0 PWL file="C:\Users\User\Google Drive\Thesis_shared_folder\anik_thesis\simulations\pattern_with_memristor\pwm_files\R_172_1.txt"
V346 N700 0 PWL file="C:\Users\User\Google Drive\Thesis_shared_folder\anik_thesis\simulations\pattern_with_memristor\pwm_files\R_173_1.txt"
V348 N704 0 PWL file="C:\Users\User\Google Drive\Thesis_shared_folder\anik_thesis\simulations\pattern_with_memristor\pwm_files\R_174_1.txt"
V350 N708 0 PWL file="C:\Users\User\Google Drive\Thesis_shared_folder\anik_thesis\simulations\pattern_with_memristor\pwm_files\R_175_1.txt"
V352 N712 0 PWL file="C:\Users\User\Google Drive\Thesis_shared_folder\anik_thesis\simulations\pattern_with_memristor\pwm_files\R_176_1.txt"
V354 N716 0 PWL file="C:\Users\User\Google Drive\Thesis_shared_folder\anik_thesis\simulations\pattern_with_memristor\pwm_files\R_177_1.txt"
V356 N720 0 PWL file="C:\Users\User\Google Drive\Thesis_shared_folder\anik_thesis\simulations\pattern_with_memristor\pwm_files\R_178_1.txt"
V358 N724 0 PWL file="C:\Users\User\Google Drive\Thesis_shared_folder\anik_thesis\simulations\pattern_with_memristor\pwm_files\R_179_1.txt"
V360 N727 0 PWL file="C:\Users\User\Google Drive\Thesis_shared_folder\anik_thesis\simulations\pattern_with_memristor\pwm_files\R_180_1.txt"
Xsixth_block N729 181_NOT N733 182_NOT N737 183_NOT N741 184_NOT N745 185_NOT N749 186_NOT N753 187_NOT N757 188_NOT N007 N761 189_NOT N765 190_NOT N769 191_NOT N773 192_NOT N777 193_NOT N781 194_NOT N785 195_NOT N789 196_NOT N793 197_NOT N797 198_NOT N801 199_NOT N805 200_NOT N809 201_NOT N813 202_NOT N817 203_NOT N821 204_NOT N825 205_NOT N829 206_NOT N833 207_NOT N837 208_NOT N841 209_NOT N845 210_NOT N849 211_NOT N853 212_NOT N857 213_NOT N861 214_NOT N865 215_NOT N869 216_NOT memristor_block
V362 N729 0 PWL file="C:\Users\User\Google Drive\Thesis_shared_folder\anik_thesis\simulations\pattern_with_memristor\pwm_files\R_181_1.txt"
V364 N733 0 PWL file="C:\Users\User\Google Drive\Thesis_shared_folder\anik_thesis\simulations\pattern_with_memristor\pwm_files\R_182_1.txt"
V366 N737 0 PWL file="C:\Users\User\Google Drive\Thesis_shared_folder\anik_thesis\simulations\pattern_with_memristor\pwm_files\R_183_1.txt"
V368 N741 0 PWL file="C:\Users\User\Google Drive\Thesis_shared_folder\anik_thesis\simulations\pattern_with_memristor\pwm_files\R_184_1.txt"
V370 N745 0 PWL file="C:\Users\User\Google Drive\Thesis_shared_folder\anik_thesis\simulations\pattern_with_memristor\pwm_files\R_185_1.txt"
V372 N749 0 PWL file="C:\Users\User\Google Drive\Thesis_shared_folder\anik_thesis\simulations\pattern_with_memristor\pwm_files\R_186_1.txt"
V374 N753 0 PWL file="C:\Users\User\Google Drive\Thesis_shared_folder\anik_thesis\simulations\pattern_with_memristor\pwm_files\R_187_1.txt"
V376 N757 0 PWL file="C:\Users\User\Google Drive\Thesis_shared_folder\anik_thesis\simulations\pattern_with_memristor\pwm_files\R_188_1.txt"
V378 N761 0 PWL file="C:\Users\User\Google Drive\Thesis_shared_folder\anik_thesis\simulations\pattern_with_memristor\pwm_files\R_189_1.txt"
V380 N765 0 PWL file="C:\Users\User\Google Drive\Thesis_shared_folder\anik_thesis\simulations\pattern_with_memristor\pwm_files\R_190_1.txt"
V382 N769 0 PWL file="C:\Users\User\Google Drive\Thesis_shared_folder\anik_thesis\simulations\pattern_with_memristor\pwm_files\R_191_1.txt"
V384 N773 0 PWL file="C:\Users\User\Google Drive\Thesis_shared_folder\anik_thesis\simulations\pattern_with_memristor\pwm_files\R_192_1.txt"
V386 N777 0 PWL file="C:\Users\User\Google Drive\Thesis_shared_folder\anik_thesis\simulations\pattern_with_memristor\pwm_files\R_193_1.txt"
V388 N781 0 PWL file="C:\Users\User\Google Drive\Thesis_shared_folder\anik_thesis\simulations\pattern_with_memristor\pwm_files\R_194_1.txt"
V390 N785 NC_07 PWL file="C:\Users\User\Google Drive\Thesis_shared_folder\anik_thesis\simulations\pattern_with_memristor\pwm_files\R_1951.txt"
V392 N789 0 PWL file="C:\Users\User\Google Drive\Thesis_shared_folder\anik_thesis\simulations\pattern_with_memristor\pwm_files\R_196_1.txt"
V394 N793 0 PWL file="C:\Users\User\Google Drive\Thesis_shared_folder\anik_thesis\simulations\pattern_with_memristor\pwm_files\R_197_1.txt"
V396 N797 NC_08 PWL file="C:\Users\User\Google Drive\Thesis_shared_folder\anik_thesis\simulations\pattern_with_memristor\pwm_files\R_198_1.txt"
V398 N801 0 PWL file="C:\Users\User\Google Drive\Thesis_shared_folder\anik_thesis\simulations\pattern_with_memristor\pwm_files\R_199_1.txt"
V400 N805 0 PWL file="C:\Users\User\Google Drive\Thesis_shared_folder\anik_thesis\simulations\pattern_with_memristor\pwm_files\R_200_1.txt"
V402 N809 0 PWL file="C:\Users\User\Google Drive\Thesis_shared_folder\anik_thesis\simulations\pattern_with_memristor\pwm_files\R_201_1.txt"
V404 N813 0 PWL file="C:\Users\User\Google Drive\Thesis_shared_folder\anik_thesis\simulations\pattern_with_memristor\pwm_files\R_202_1.txt"
V406 N817 0 PWL file="C:\Users\User\Google Drive\Thesis_shared_folder\anik_thesis\simulations\pattern_with_memristor\pwm_files\R_203_1.txt"
V408 N821 0 PWL file="C:\Users\User\Google Drive\Thesis_shared_folder\anik_thesis\simulations\pattern_with_memristor\pwm_files\R_204_1.txt"
V410 N825 0 PWL file="C:\Users\User\Google Drive\Thesis_shared_folder\anik_thesis\simulations\pattern_with_memristor\pwm_files\R_205_1.txt"
V412 N829 0 PWL file="C:\Users\User\Google Drive\Thesis_shared_folder\anik_thesis\simulations\pattern_with_memristor\pwm_files\R_206_1.txt"
V414 N833 0 PWL file="C:\Users\User\Google Drive\Thesis_shared_folder\anik_thesis\simulations\pattern_with_memristor\pwm_files\R_207_1.txt"
V416 N837 0 PWL file="C:\Users\User\Google Drive\Thesis_shared_folder\anik_thesis\simulations\pattern_with_memristor\pwm_files\R_208_1.txt"
V418 N841 0 PWL file="C:\Users\User\Google Drive\Thesis_shared_folder\anik_thesis\simulations\pattern_with_memristor\pwm_files\R_209_1.txt"
V420 N845 0 PWL file="C:\Users\User\Google Drive\Thesis_shared_folder\anik_thesis\simulations\pattern_with_memristor\pwm_files\R_210_1.txt"
V422 N849 0 PWL file="C:\Users\User\Google Drive\Thesis_shared_folder\anik_thesis\simulations\pattern_with_memristor\pwm_files\R_211_1.txt"
V424 N853 0 PWL file="C:\Users\User\Google Drive\Thesis_shared_folder\anik_thesis\simulations\pattern_with_memristor\pwm_files\R_212_1.txt"
V426 N857 0 PWL file="C:\Users\User\Google Drive\Thesis_shared_folder\anik_thesis\simulations\pattern_with_memristor\pwm_files\R_213_1.txt"
V428 N861 0 PWL file="C:\Users\User\Google Drive\Thesis_shared_folder\anik_thesis\simulations\pattern_with_memristor\pwm_files\R_214_1.txt"
V430 N865 0 PWL file="C:\Users\User\Google Drive\Thesis_shared_folder\anik_thesis\simulations\pattern_with_memristor\pwm_files\R_215_1.txt"
V432 N869 0 PWL file="C:\Users\User\Google Drive\Thesis_shared_folder\anik_thesis\simulations\pattern_with_memristor\pwm_files\R_216_1.txt"
Xseventh_block N873 217_NOT N875 218_NOT N879 219_NOT N883 220_NOT N887 221_NOT N891 222_NOT N895 223_NOT N899 224_NOT N007 N903 225_NOT N907 226_NOT N911 227_NOT N915 228_NOT N919 229_NOT N923 230_NOT N927 231_NOT N931 232_NOT N935 233_NOT N939 234_NOT N943 235_NOT N947 236_NOT N951 237_NOT N955 238_NOT N959 239_NOT N963 240_NOT N967 241_NOT N971 242_NOT N975 243_NOT N979 244_NOT N983 245_NOT N987 246_NOT N991 247_NOT N995 248_NOT N999 249_NOT N1003 250_NOT N1007 251_NOT N1011 252_NOT memristor_block
V434 N873 0 PWL file="C:\Users\User\Google Drive\Thesis_shared_folder\anik_thesis\simulations\pattern_with_memristor\pwm_files\R_217_1.txt"
V436 N875 0 PWL file="C:\Users\User\Google Drive\Thesis_shared_folder\anik_thesis\simulations\pattern_with_memristor\pwm_files\R_218_1.txt"
V438 N879 0 PWL file="C:\Users\User\Google Drive\Thesis_shared_folder\anik_thesis\simulations\pattern_with_memristor\pwm_files\R_219_1.txt"
V440 N883 0 PWL file="C:\Users\User\Google Drive\Thesis_shared_folder\anik_thesis\simulations\pattern_with_memristor\pwm_files\R_220_1.txt"
V442 N887 0 PWL file="C:\Users\User\Google Drive\Thesis_shared_folder\anik_thesis\simulations\pattern_with_memristor\pwm_files\R_221_1.txt"
V444 N891 0 PWL file="C:\Users\User\Google Drive\Thesis_shared_folder\anik_thesis\simulations\pattern_with_memristor\pwm_files\R_222_1.txt"
V446 N895 0 PWL file="C:\Users\User\Google Drive\Thesis_shared_folder\anik_thesis\simulations\pattern_with_memristor\pwm_files\R_223_1.txt"
V448 N899 0 PWL file="C:\Users\User\Google Drive\Thesis_shared_folder\anik_thesis\simulations\pattern_with_memristor\pwm_files\R_224_1.txt"
V450 N903 0 PWL file="C:\Users\User\Google Drive\Thesis_shared_folder\anik_thesis\simulations\pattern_with_memristor\pwm_files\R_225_1.txt"
V452 N907 0 PWL file="C:\Users\User\Google Drive\Thesis_shared_folder\anik_thesis\simulations\pattern_with_memristor\pwm_files\R_226_1.txt"
V454 N911 0 PWL file="C:\Users\User\Google Drive\Thesis_shared_folder\anik_thesis\simulations\pattern_with_memristor\pwm_files\R_227_1.txt"
V456 N915 0 PWL file="C:\Users\User\Google Drive\Thesis_shared_folder\anik_thesis\simulations\pattern_with_memristor\pwm_files\R_228_1.txt"
V458 N919 0 PWL file="C:\Users\User\Google Drive\Thesis_shared_folder\anik_thesis\simulations\pattern_with_memristor\pwm_files\R_229_1.txt"
V460 N923 0 PWL file="C:\Users\User\Google Drive\Thesis_shared_folder\anik_thesis\simulations\pattern_with_memristor\pwm_files\R_230_1.txt"
V462 N927 NC_09 PWL file="C:\Users\User\Google Drive\Thesis_shared_folder\anik_thesis\simulations\pattern_with_memristor\pwm_files\R_231_1.txt"
V464 N931 0 PWL file="C:\Users\User\Google Drive\Thesis_shared_folder\anik_thesis\simulations\pattern_with_memristor\pwm_files\R_232_1.txt"
V466 N935 0 PWL file="C:\Users\User\Google Drive\Thesis_shared_folder\anik_thesis\simulations\pattern_with_memristor\pwm_files\R_233_1.txt"
V468 N939 NC_10 PWL file="C:\Users\User\Google Drive\Thesis_shared_folder\anik_thesis\simulations\pattern_with_memristor\pwm_files\R_234_1.txt"
V470 N943 0 PWL file="C:\Users\User\Google Drive\Thesis_shared_folder\anik_thesis\simulations\pattern_with_memristor\pwm_files\R_235_1.txt"
V472 N947 0 PWL file="C:\Users\User\Google Drive\Thesis_shared_folder\anik_thesis\simulations\pattern_with_memristor\pwm_files\R_236_1.txt"
V474 N951 0 PWL file="C:\Users\User\Google Drive\Thesis_shared_folder\anik_thesis\simulations\pattern_with_memristor\pwm_files\R_237_1.txt"
V476 N955 0 PWL file="C:\Users\User\Google Drive\Thesis_shared_folder\anik_thesis\simulations\pattern_with_memristor\pwm_files\R_238_1.txt"
V478 N959 0 PWL file="C:\Users\User\Google Drive\Thesis_shared_folder\anik_thesis\simulations\pattern_with_memristor\pwm_files\R_239_1.txt"
V480 N963 0 PWL file="C:\Users\User\Google Drive\Thesis_shared_folder\anik_thesis\simulations\pattern_with_memristor\pwm_files\R_240_1.txt"
V482 N967 0 PWL file="C:\Users\User\Google Drive\Thesis_shared_folder\anik_thesis\simulations\pattern_with_memristor\pwm_files\R_241_1.txt"
V484 N971 0 PWL file="C:\Users\User\Google Drive\Thesis_shared_folder\anik_thesis\simulations\pattern_with_memristor\pwm_files\R_242_1.txt"
V486 N975 0 PWL file="C:\Users\User\Google Drive\Thesis_shared_folder\anik_thesis\simulations\pattern_with_memristor\pwm_files\R_243_1.txt"
V488 N979 0 PWL file="C:\Users\User\Google Drive\Thesis_shared_folder\anik_thesis\simulations\pattern_with_memristor\pwm_files\R_244_1.txt"
V490 N983 0 PWL file="C:\Users\User\Google Drive\Thesis_shared_folder\anik_thesis\simulations\pattern_with_memristor\pwm_files\R_245_1.txt"
V492 N987 0 PWL file="C:\Users\User\Google Drive\Thesis_shared_folder\anik_thesis\simulations\pattern_with_memristor\pwm_files\R_246_1.txt"
V494 N991 0 PWL file="C:\Users\User\Google Drive\Thesis_shared_folder\anik_thesis\simulations\pattern_with_memristor\pwm_files\R_247_1.txt"
V496 N995 0 PWL file="C:\Users\User\Google Drive\Thesis_shared_folder\anik_thesis\simulations\pattern_with_memristor\pwm_files\R_248_1.txt"
V498 N999 0 PWL file="C:\Users\User\Google Drive\Thesis_shared_folder\anik_thesis\simulations\pattern_with_memristor\pwm_files\R_249_1.txt"
V500 N1003 0 PWL file="C:\Users\User\Google Drive\Thesis_shared_folder\anik_thesis\simulations\pattern_with_memristor\pwm_files\R_250_1.txt"
V502 N1007 0 PWL file="C:\Users\User\Google Drive\Thesis_shared_folder\anik_thesis\simulations\pattern_with_memristor\pwm_files\R_251_1.txt"
V504 N1011 0 PWL file="C:\Users\User\Google Drive\Thesis_shared_folder\anik_thesis\simulations\pattern_with_memristor\pwm_files\R_252_1.txt"
Xeight_block N1017 253_NOT N1018 254_NOT N1021 255_NOT N1025 256_NOT N1029 257_NOT N1033 258_NOT N1037 259_NOT N1041 260_NOT N007 N1045 261_NOT N1049 262_NOT N1053 263_NOT N1057 264_NOT N1061 265_NOT N1065 266_NOT N1069 267_NOT N1073 268_NOT N1077 269_NOT N1081 270_NOT N1085 271_NOT N1089 272_NOT N1093 273_NOT N1097 274_NOT N1101 275_NOT N1105 276_NOT N1109 277_NOT N1113 278_NOT N1117 279_NOT N1121 280_NOT N1125 281_NOT N1129 282_NOT N1133 283_NOT N1137 284_NOT N1141 285_NOT N1145 286_NOT N1149 287_NOT N1153 288_NOT memristor_block
V506 N1017 0 PWL file="C:\Users\User\Google Drive\Thesis_shared_folder\anik_thesis\simulations\pattern_with_memristor\pwm_files\R_253_1.txt"
V508 N1018 0 PWL file="C:\Users\User\Google Drive\Thesis_shared_folder\anik_thesis\simulations\pattern_with_memristor\pwm_files\R_254_1.txt"
V510 N1021 0 PWL file="C:\Users\User\Google Drive\Thesis_shared_folder\anik_thesis\simulations\pattern_with_memristor\pwm_files\R_255_1.txt"
V512 N1025 0 PWL file="C:\Users\User\Google Drive\Thesis_shared_folder\anik_thesis\simulations\pattern_with_memristor\pwm_files\R_256_1.txt"
V514 N1029 0 PWL file="C:\Users\User\Google Drive\Thesis_shared_folder\anik_thesis\simulations\pattern_with_memristor\pwm_files\R_257_1.txt"
V516 N1033 0 PWL file="C:\Users\User\Google Drive\Thesis_shared_folder\anik_thesis\simulations\pattern_with_memristor\pwm_files\R_258_1.txt"
V518 N1037 0 PWL file="C:\Users\User\Google Drive\Thesis_shared_folder\anik_thesis\simulations\pattern_with_memristor\pwm_files\R_259_1.txt"
V520 N1041 0 PWL file="C:\Users\User\Google Drive\Thesis_shared_folder\anik_thesis\simulations\pattern_with_memristor\pwm_files\R_260_1.txt"
V522 N1045 0 PWL file="C:\Users\User\Google Drive\Thesis_shared_folder\anik_thesis\simulations\pattern_with_memristor\pwm_files\R_261_1.txt"
V524 N1049 0 PWL file="C:\Users\User\Google Drive\Thesis_shared_folder\anik_thesis\simulations\pattern_with_memristor\pwm_files\R_262_1.txt"
V526 N1053 0 PWL file="C:\Users\User\Google Drive\Thesis_shared_folder\anik_thesis\simulations\pattern_with_memristor\pwm_files\R_263_1.txt"
V528 N1057 0 PWL file="C:\Users\User\Google Drive\Thesis_shared_folder\anik_thesis\simulations\pattern_with_memristor\pwm_files\R_264_1.txt"
V530 N1061 0 PWL file="C:\Users\User\Google Drive\Thesis_shared_folder\anik_thesis\simulations\pattern_with_memristor\pwm_files\R_265_1.txt"
V532 N1065 0 PWL file="C:\Users\User\Google Drive\Thesis_shared_folder\anik_thesis\simulations\pattern_with_memristor\pwm_files\R_266_1.txt"
V534 N1069 NC_11 PWL file="C:\Users\User\Google Drive\Thesis_shared_folder\anik_thesis\simulations\pattern_with_memristor\pwm_files\R_267_1.txt"
V536 N1073 0 PWL file="C:\Users\User\Google Drive\Thesis_shared_folder\anik_thesis\simulations\pattern_with_memristor\pwm_files\R_268_1.txt"
V538 N1077 0 PWL file="C:\Users\User\Google Drive\Thesis_shared_folder\anik_thesis\simulations\pattern_with_memristor\pwm_files\R_269_1.txt"
V540 N1081 NC_12 PWL file="C:\Users\User\Google Drive\Thesis_shared_folder\anik_thesis\simulations\pattern_with_memristor\pwm_files\R_270_1.txt"
V542 N1085 0 PWL file="C:\Users\User\Google Drive\Thesis_shared_folder\anik_thesis\simulations\pattern_with_memristor\pwm_files\R_271_1.txt"
V544 N1089 0 PWL file="C:\Users\User\Google Drive\Thesis_shared_folder\anik_thesis\simulations\pattern_with_memristor\pwm_files\R_272_1.txt"
V546 N1093 0 PWL file="C:\Users\User\Google Drive\Thesis_shared_folder\anik_thesis\simulations\pattern_with_memristor\pwm_files\R_273_1.txt"
V548 N1097 0 PWL file="C:\Users\User\Google Drive\Thesis_shared_folder\anik_thesis\simulations\pattern_with_memristor\pwm_files\R_274_1.txt"
V550 N1101 0 PWL file="C:\Users\User\Google Drive\Thesis_shared_folder\anik_thesis\simulations\pattern_with_memristor\pwm_files\R_275_1.txt"
V552 N1105 0 PWL file="C:\Users\User\Google Drive\Thesis_shared_folder\anik_thesis\simulations\pattern_with_memristor\pwm_files\R_276_1.txt"
V554 N1109 0 PWL file="C:\Users\User\Google Drive\Thesis_shared_folder\anik_thesis\simulations\pattern_with_memristor\pwm_files\R_277_1.txt"
V556 N1113 0 PWL file="C:\Users\User\Google Drive\Thesis_shared_folder\anik_thesis\simulations\pattern_with_memristor\pwm_files\R_278_1.txt"
V558 N1117 0 PWL file="C:\Users\User\Google Drive\Thesis_shared_folder\anik_thesis\simulations\pattern_with_memristor\pwm_files\R_279_1.txt"
V560 N1121 0 PWL file="C:\Users\User\Google Drive\Thesis_shared_folder\anik_thesis\simulations\pattern_with_memristor\pwm_files\R_280_1.txt"
V562 N1125 0 PWL file="C:\Users\User\Google Drive\Thesis_shared_folder\anik_thesis\simulations\pattern_with_memristor\pwm_files\R_281_1.txt"
V564 N1129 0 PWL file="C:\Users\User\Google Drive\Thesis_shared_folder\anik_thesis\simulations\pattern_with_memristor\pwm_files\R_282_1.txt"
V566 N1133 0 PWL file="C:\Users\User\Google Drive\Thesis_shared_folder\anik_thesis\simulations\pattern_with_memristor\pwm_files\R_283_1.txt"
V568 N1137 0 PWL file="C:\Users\User\Google Drive\Thesis_shared_folder\anik_thesis\simulations\pattern_with_memristor\pwm_files\R_284_1.txt"
V570 N1141 0 PWL file="C:\Users\User\Google Drive\Thesis_shared_folder\anik_thesis\simulations\pattern_with_memristor\pwm_files\R_285_1.txt"
V572 N1145 0 PWL file="C:\Users\User\Google Drive\Thesis_shared_folder\anik_thesis\simulations\pattern_with_memristor\pwm_files\R_286_1.txt"
V574 N1149 0 PWL file="C:\Users\User\Google Drive\Thesis_shared_folder\anik_thesis\simulations\pattern_with_memristor\pwm_files\R_287_1.txt"
V576 N1153 0 PWL file="C:\Users\User\Google Drive\Thesis_shared_folder\anik_thesis\simulations\pattern_with_memristor\pwm_files\R_288_1.txt"
Xnine_block N1161 289_NOT N1163 290_NOT N1167 291_NOT N1171 292_NOT N1175 293_NOT N1179 294_NOT N1183 295_NOT N1187 296_NOT N007 N1191 297_NOT N1195 298_NOT N1199 299_NOT N1203 300_NOT N1207 301_NOT N1211 302_NOT N1215 303_NOT N1219 304_NOT N1223 305_NOT N1227 306_NOT N1231 307_NOT N1235 308_NOT N1239 309_NOT N1243 310_NOT N1247 311_NOT N1251 312_NOT N1255 313_NOT N1259 314_NOT N1263 315_NOT N1267 316_NOT N1271 317_NOT N1275 318_NOT N1279 319_NOT N1283 320_NOT N1287 321_NOT N1291 322_NOT N1295 323_NOT N1299 324_NOT memristor_block
V578 N1161 0 PWL file="C:\Users\User\Google Drive\Thesis_shared_folder\anik_thesis\simulations\pattern_with_memristor\pwm_files\R_289_1.txt"
V580 N1163 0 PWL file="C:\Users\User\Google Drive\Thesis_shared_folder\anik_thesis\simulations\pattern_with_memristor\pwm_files\R_290_1.txt"
V582 N1167 0 PWL file="C:\Users\User\Google Drive\Thesis_shared_folder\anik_thesis\simulations\pattern_with_memristor\pwm_files\R_290_1.txt"
V584 N1171 0 PWL file="C:\Users\User\Google Drive\Thesis_shared_folder\anik_thesis\simulations\pattern_with_memristor\pwm_files\R_292_1.txt"
V586 N1175 0 PWL file="C:\Users\User\Google Drive\Thesis_shared_folder\anik_thesis\simulations\pattern_with_memristor\pwm_files\R_293_1.txt"
V588 N1179 0 PWL file="C:\Users\User\Google Drive\Thesis_shared_folder\anik_thesis\simulations\pattern_with_memristor\pwm_files\R_294_1.txt"
V590 N1183 0 PWL file="C:\Users\User\Google Drive\Thesis_shared_folder\anik_thesis\simulations\pattern_with_memristor\pwm_files\R_295_1.txt"
V592 N1187 0 PWL file="C:\Users\User\Google Drive\Thesis_shared_folder\anik_thesis\simulations\pattern_with_memristor\pwm_files\R_296_1.txt"
V594 N1191 0 PWL file="C:\Users\User\Google Drive\Thesis_shared_folder\anik_thesis\simulations\pattern_with_memristor\pwm_files\R_297_1.txt"
V596 N1195 0 PWL file="C:\Users\User\Google Drive\Thesis_shared_folder\anik_thesis\simulations\pattern_with_memristor\pwm_files\R_298_1.txt"
V598 N1199 0 PWL file="C:\Users\User\Google Drive\Thesis_shared_folder\anik_thesis\simulations\pattern_with_memristor\pwm_files\R_299_1.txt"
V600 N1203 0 PWL file="C:\Users\User\Google Drive\Thesis_shared_folder\anik_thesis\simulations\pattern_with_memristor\pwm_files\R_300_1.txt"
V602 N1207 0 PWL file="C:\Users\User\Google Drive\Thesis_shared_folder\anik_thesis\simulations\pattern_with_memristor\pwm_files\R_301_1.txt"
V604 N1211 0 PWL file="C:\Users\User\Google Drive\Thesis_shared_folder\anik_thesis\simulations\pattern_with_memristor\pwm_files\R_302_1.txt"
V606 N1215 0 PWL file="C:\Users\User\Google Drive\Thesis_shared_folder\anik_thesis\simulations\pattern_with_memristor\pwm_files\R_303_1.txt"
V608 N1219 0 PWL file="C:\Users\User\Google Drive\Thesis_shared_folder\anik_thesis\simulations\pattern_with_memristor\pwm_files\R_304_1.txt"
V610 N1223 0 PWL file="C:\Users\User\Google Drive\Thesis_shared_folder\anik_thesis\simulations\pattern_with_memristor\pwm_files\R_305_1.txt"
V612 N1227 NC_13 PWL file="C:\Users\User\Google Drive\Thesis_shared_folder\anik_thesis\simulations\pattern_with_memristor\pwm_files\R_306_1.txt"
V614 N1231 0 PWL file="C:\Users\User\Google Drive\Thesis_shared_folder\anik_thesis\simulations\pattern_with_memristor\pwm_files\R_307_1.txt"
V616 N1235 0 PWL file="C:\Users\User\Google Drive\Thesis_shared_folder\anik_thesis\simulations\pattern_with_memristor\pwm_files\R_308_1.txt"
V618 N1239 0 PWL file="C:\Users\User\Google Drive\Thesis_shared_folder\anik_thesis\simulations\pattern_with_memristor\pwm_files\R_309_1.txt"
V620 N1243 0 PWL file="C:\Users\User\Google Drive\Thesis_shared_folder\anik_thesis\simulations\pattern_with_memristor\pwm_files\R_310_1.txt"
V622 N1247 0 PWL file="C:\Users\User\Google Drive\Thesis_shared_folder\anik_thesis\simulations\pattern_with_memristor\pwm_files\R_311_1.txt"
V624 N1251 0 PWL file="C:\Users\User\Google Drive\Thesis_shared_folder\anik_thesis\simulations\pattern_with_memristor\pwm_files\R_312_1.txt"
V626 N1255 0 PWL file="C:\Users\User\Google Drive\Thesis_shared_folder\anik_thesis\simulations\pattern_with_memristor\pwm_files\R_313_1.txt"
V628 N1259 0 PWL file="C:\Users\User\Google Drive\Thesis_shared_folder\anik_thesis\simulations\pattern_with_memristor\pwm_files\R_314_1.txt"
V630 N1263 0 PWL file="C:\Users\User\Google Drive\Thesis_shared_folder\anik_thesis\simulations\pattern_with_memristor\pwm_files\R_315_1.txt"